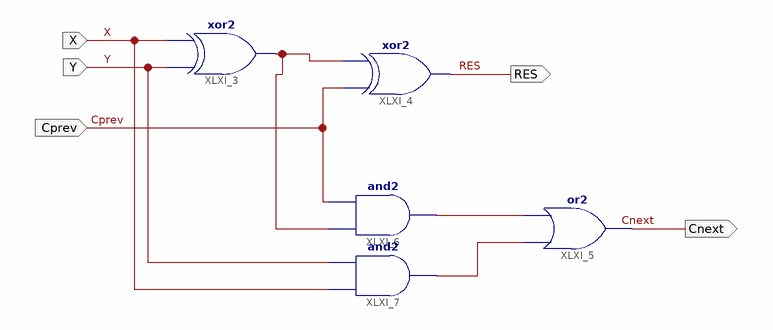
[diagram p0: schematic sheet 1]
// Xilinx ISE schematic fa_sch.sch (spartan3e) as structural Verilog: 5 symbols, 5 ports
module fa_sch (
  input  Cprev,
  input  Y,
  input  X,
  output RES,
  output Cnext
);

  wire XLXN_1, XLXN_6, XLXN_7;

  xor XLXI_3 (XLXN_1, Y, X);
  xor XLXI_4 (RES, Cprev, XLXN_1);
  or XLXI_5 (Cnext, XLXN_7, XLXN_6);
  and XLXI_6 (XLXN_6, XLXN_1, Cprev);
  and XLXI_7 (XLXN_7, X, Y);
endmodule
